# Altium schematic sheet STM32_test_board_schematic.SchDoc
size A3
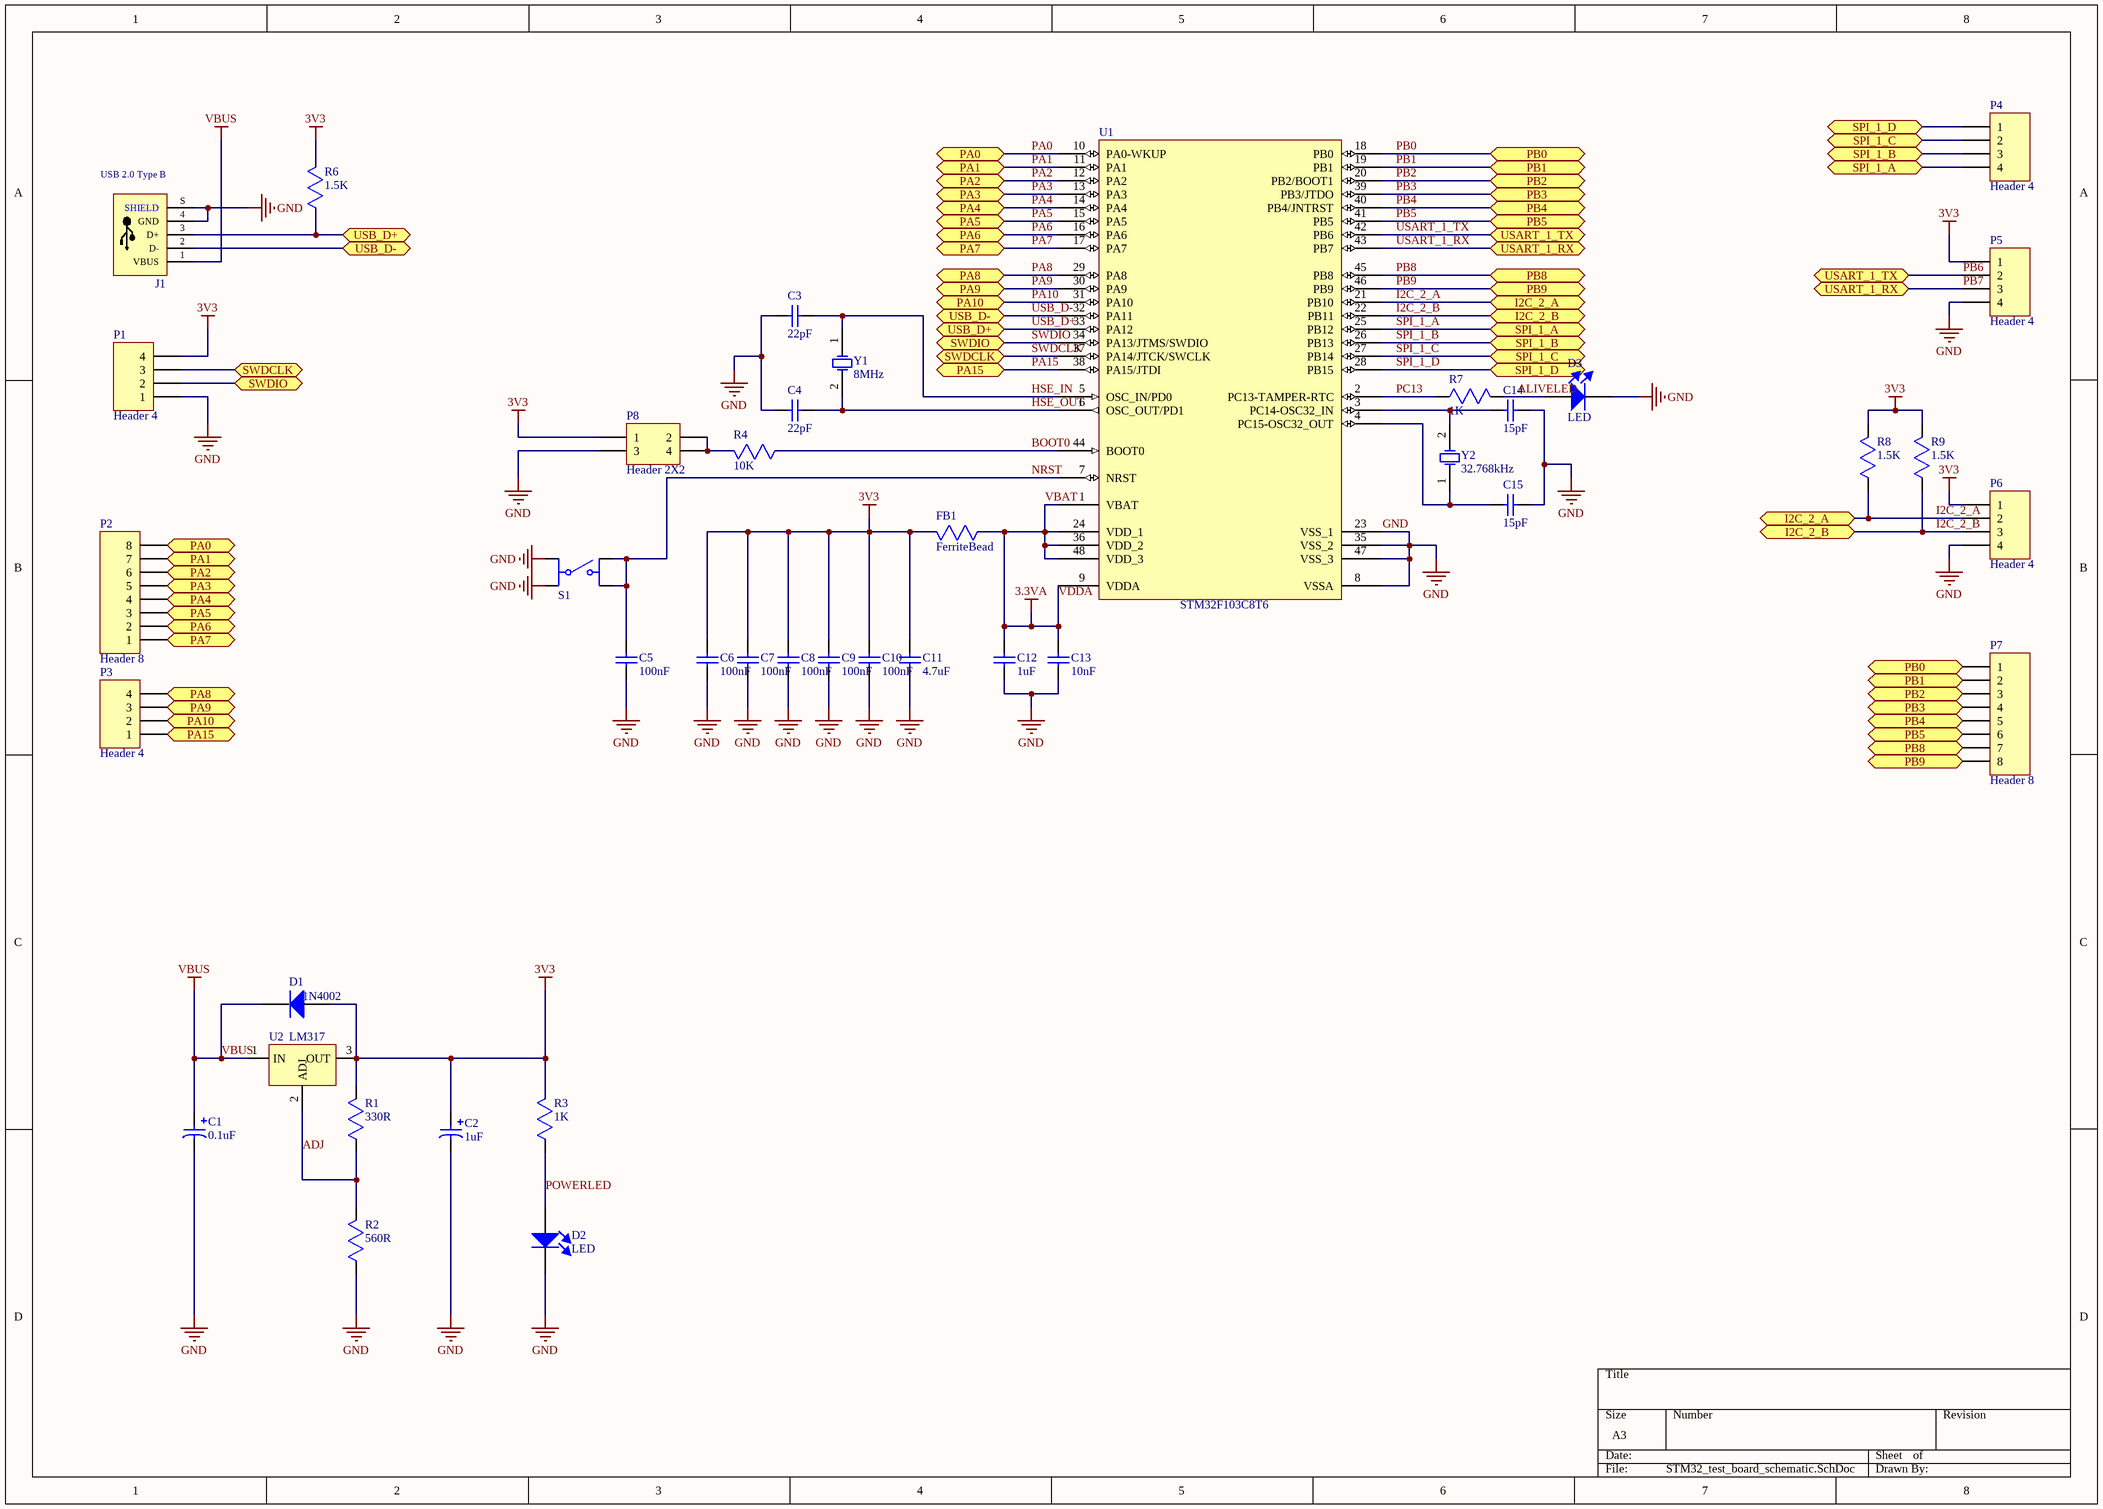
[diagram p0: STM32_test_board_schematic.SchDoc]

## Parts
C1  0.1uF  [Electrolytic_Cap_1_5mm]
C2  1uF  [Electrolytic_CAP_2mm]
C3  22pF  [THT_CEREMIC_CAP_254]
C4  22pF  [THT_CEREMIC_CAP_254]
C5  100nF  [THT_CEREMIC_CAP_254]
C6  100nF  [THT_CEREMIC_CAP_254]
C7  100nF  [THT_CEREMIC_CAP_254]
C8  100nF  [THT_CEREMIC_CAP_254]
C9  100nF  [THT_CEREMIC_CAP_254]
C10  100nF  [THT_CEREMIC_CAP_254]
C11  4.7uF  [THT_Tantal_Cap_254]
C12  1uF  [THT_CEREMIC_CAP_254]
C13  10nF  [THT_CEREMIC_CAP_254]
C14  15pF  [THT_CEREMIC_CAP_254]
C15  15pF  [THT_CEREMIC_CAP_254]
D1  1N4002  [DO-35]
D2  LED  [LED]
D3  LED  [LED]
FB1  FerriteBead  [AxialMetalFilmResistors]
J1  USB 2.0 Type B  [USB2_0_B_DIP]
P1  Header 4  [HDR1X4]
P2  Header 8  [HDR1X8]
P3  Header 4  [HDR1X4]
P4  Header 4  [HDR1X4]
P5  Header 4  [HDR1X4]
P6  Header 4  [HDR1X4]
P7  Header 8  [HDR1X8]
P8  Header 2X2  [HDR2X2]
R1  value 330R  [AxialMetalFilmResistors]  (hidden comment: Resistor)
R2  value 560R  [AxialMetalFilmResistors]  (hidden comment: Resistor)
R3  value 1K  [AxialMetalFilmResistors]  (hidden comment: Resistor)
R4  value 10K  [AxialMetalFilmResistors]  (hidden comment: Resistor)
R6  value 1.5K  [AxialMetalFilmResistors]  (hidden comment: Resistor)
R7  value 1K  [AxialMetalFilmResistors]  (hidden comment: Resistor)
R8  value 1.5K  [AxialMetalFilmResistors]  (hidden comment: Resistor)
R9  value 1.5K  [AxialMetalFilmResistors]  (hidden comment: Resistor)
S1  PushButton  [PushButton]  (value not drawn)
U1  STM32F103C8T6  [LQFP48_N]
U2  LM317  [TO220-3]
Y1  8MHz  [OSC]
Y2  32.768kHz  [OSC_Round]

## Ports
I2C_2_A (bidir), I2C_2_B (bidir), PA0 (bidir), PA1 (bidir), PA2 (bidir), PA3 (bidir), PA4 (bidir), PA5 (bidir), PA6 (bidir), PA7 (bidir), PA8 (bidir), PA9 (bidir), PA10 (bidir), PA15 (bidir), PB0 (bidir), PB1 (bidir), PB2 (bidir), PB3 (bidir), PB4 (bidir), PB5 (bidir), PB8 (bidir), PB9 (bidir), SPI_1_A (bidir), SPI_1_B (bidir), SPI_1_C (bidir), SPI_1_D (bidir), SWDCLK (bidir), SWDIO (bidir), USART_1_RX (bidir), USART_1_TX (bidir), USB_D+ (bidir), USB_D- (bidir)

## Nets
3V3: C2.2 C6.1 C7.1 C8.1 C9.1 C10.1 C11.1 D1.1(A) FB1.2 P1.4 P5.1 P6.1 P8.1 R3.2 R6.2 U2.3(OUT)
GND: C1.1 C2.1 C3.1 C4.1 C5.2 C6.2 C7.2 C8.2 C9.2 C10.2 C11.2 C12.2 C13.2 C14.2 C15.2 D2.2 D3.2 J1.4(GND) J1.S(SHIELD) P1.1 P5.4 P6.4 P8.3 S1.1 S1.2 U1.8(VSSA) U1.23(VSS_1) U1.35(VSS_2) U1.47(VSS_3)
VBAT: C12.1 C13.1 FB1.1 U1.1(VBAT) U1.9(VDDA) U1.24(VDD_1) U1.36(VDD_2) U1.48(VDD_3)  [also labelled 3.3VA, VDDA]
VBUS: C1.2 D1.2(C) J1.1(VBUS) U2.1(IN)
ADJ: U2.2(ADJ)
ALIVELED: D3.1
BOOT0: R4.1 U1.44(BOOT0)
HSE_IN: C3.2 U1.5(OSC_IN/PD0) Y1.1
HSE_OUT: C4.2 U1.6(OSC_OUT/PD1) Y1.2
I2C_2_A: P6.2 U1.21(PB10) ; port I2C_2_A
I2C_2_B: P6.3 U1.22(PB11) ; port I2C_2_B
NRST: C5.1 S1.3 S1.4 U1.7(NRST)
PA0: P2.8 U1.10(PA0-WKUP) ; port PA0
PA1: P2.7 U1.11(PA1) ; port PA1
PA2: P2.6 U1.12(PA2) ; port PA2
PA3: P2.5 U1.13(PA3) ; port PA3
PA4: P2.4 U1.14(PA4) ; port PA4
PA5: P2.3 U1.15(PA5) ; port PA5
PA6: P2.2 U1.16(PA6) ; port PA6
PA7: P2.1 U1.17(PA7) ; port PA7
PA8: P3.4 U1.29(PA8) ; port PA8
PA9: P3.3 U1.30(PA9) ; port PA9
PA10: P3.2 U1.31(PA10) ; port PA10
PA15: P3.1 U1.38(PA15/JTDI) ; port PA15
PB0: P7.1 U1.18(PB0) ; port PB0
PB1: P7.2 U1.19(PB1) ; port PB1
PB2: P7.3 U1.20(PB2/BOOT1) ; port PB2
PB3: P7.4 U1.39(PB3/JTDO) ; port PB3
PB4: P7.5 U1.40(PB4/JNTRST) ; port PB4
PB5: P7.6 U1.41(PB5) ; port PB5
PB6: P5.2 U1.42(PB6) ; port USART_1_TX  [also labelled USART_1_TX]
PB7: P5.3 U1.43(PB7) ; port USART_1_RX  [also labelled USART_1_RX]
PB8: P7.7 U1.45(PB8) ; port PB8
PB9: P7.8 U1.46(PB9) ; port PB9
PC13: U1.2(PC13-TAMPER-RTC)
POWERLED: D2.1
SPI_1_A: P4.4 U1.25(PB12) ; port SPI_1_A
SPI_1_B: P4.3 U1.26(PB13) ; port SPI_1_B
SPI_1_C: P4.2 U1.27(PB14) ; port SPI_1_C
SPI_1_D: P4.1 U1.28(PB15) ; port SPI_1_D
SWDCLK: P1.3 U1.37(PA14/JTCK/SWCLK) ; port SWDCLK
SWDIO: P1.2 U1.34(PA13/JTMS/SWDIO) ; port SWDIO
USB_D+: J1.3(D+) R6.1 U1.33(PA12) ; port USB_D+
USB_D-: J1.2(D-) U1.32(PA11) ; port USB_D-
NetC14_1: C14.1 U1.3(PC14-OSC32_IN) Y2.2
NetC15_1: C15.1 U1.4(PC15-OSC32_OUT) Y2.1
NetP8_2: P8.2 P8.4 R4.2

Not connected (* = marked no-connect by the designer): R1 1 2; R2 1 2; R3 1; R7 1 2; R8 1 2; R9 1 2

## Library data of the parts
C1 = THT_Electrolytic_Cap: 1.5mm Electrolytic; Category: Capacitors; Supplier 1: Allied
C2 = THT_Electrolytic_Cap_2: 2mm Electrolytic; Category: Capacitors; Supplier 1: Allied
C3-C10 C12-C15 = THT_Ceramic_Cap: Category: Capacitors; Supplier 1: Allied; Supplier Part Number 1: 70001689
C11 = THT_Tantal_Cap: Category: Capacitors; Supplier 1: Allied; Supplier Part Number 1: 70001689
D1 = 1N4002: Diode Standard 100V 1A Through Hole DO-41; Category: Diodes - Rectifiers - Single
FB1 = Resistor: Value: 100k; Category: Resistors
J1 = USB2_0-A&B: USB 2.0 Type A and Type B; Part Number: 61400413321; Rated Current: 1.5 A; Gender: Female; ComponentLink1Description: Manufacturer; ComponentLink1URL: http://www.we-online.de; ComponentLink2Description: Datasheet; ComponentLink2URL: http://katalog.we-online.de/em/datasheet/61400413321.pdf; Published Date: May 2018; Publisher: Wurth Elektronik; Orientation: Vertical; Interface Type: USB 2.0 Type B; Operating Temperature: -40 to 105 degC; Mounting Technology: THT; Packaging: Tray
P1 P3-P6 = Header 4: Header, 4-Pin; LatestRevisionDate: 17-Jul-2002; LatestRevisionNote: Re-released for DXP Platform.; Publisher: Altium Limited
P2 P7 = Header 8: Header, 8-Pin; LatestRevisionDate: 17-Jul-2002; LatestRevisionNote: Re-released for DXP Platform.; Publisher: Altium Limited
P8 = Header 2X2: Header, 2-Pin, Dual row; LatestRevisionDate: 17-Jul-2002; LatestRevisionNote: Re-released for DXP Platform.; Publisher: Altium Limited
U1 = STM32F103C8T6: STM32 ARM-based 32-bit MCU with 64 Kbytes Flash, 48-pin LQFP, Industrial Temperature; Published: 30-May-2008; DatasheetVersion: rev6, Mar-2008; PackageVersion: Mar-2008; PackageReference: LQFP48; Publisher: Altium Limited; PackageDescription: 48-Pin Low-Profile Quad Flat Pack, 7 x 7 mm Body, 0.5 mm Pitch (LQFP48); ComponentLink1Description: Manufacturer Link; ComponentLink1URL: www.st.com/stm32; ComponentLink2Description: Datasheet; ComponentLink2URL: http://www.st.com/stonline/products/literature/ds/13587.pdf
U2 = LM317: Linear Voltage Regulator IC Variable Output TO-220-3; Voltage Regulators - Linear: *
Y1 = OSC
Y2 = OSC_round
D2 D3 = LED: Supplier 1: Allied; Category: Optoelectronics
R1-R4 R6-R9 = Resistor: Category: Resistors
S1 = PushButton: Category: PushButton